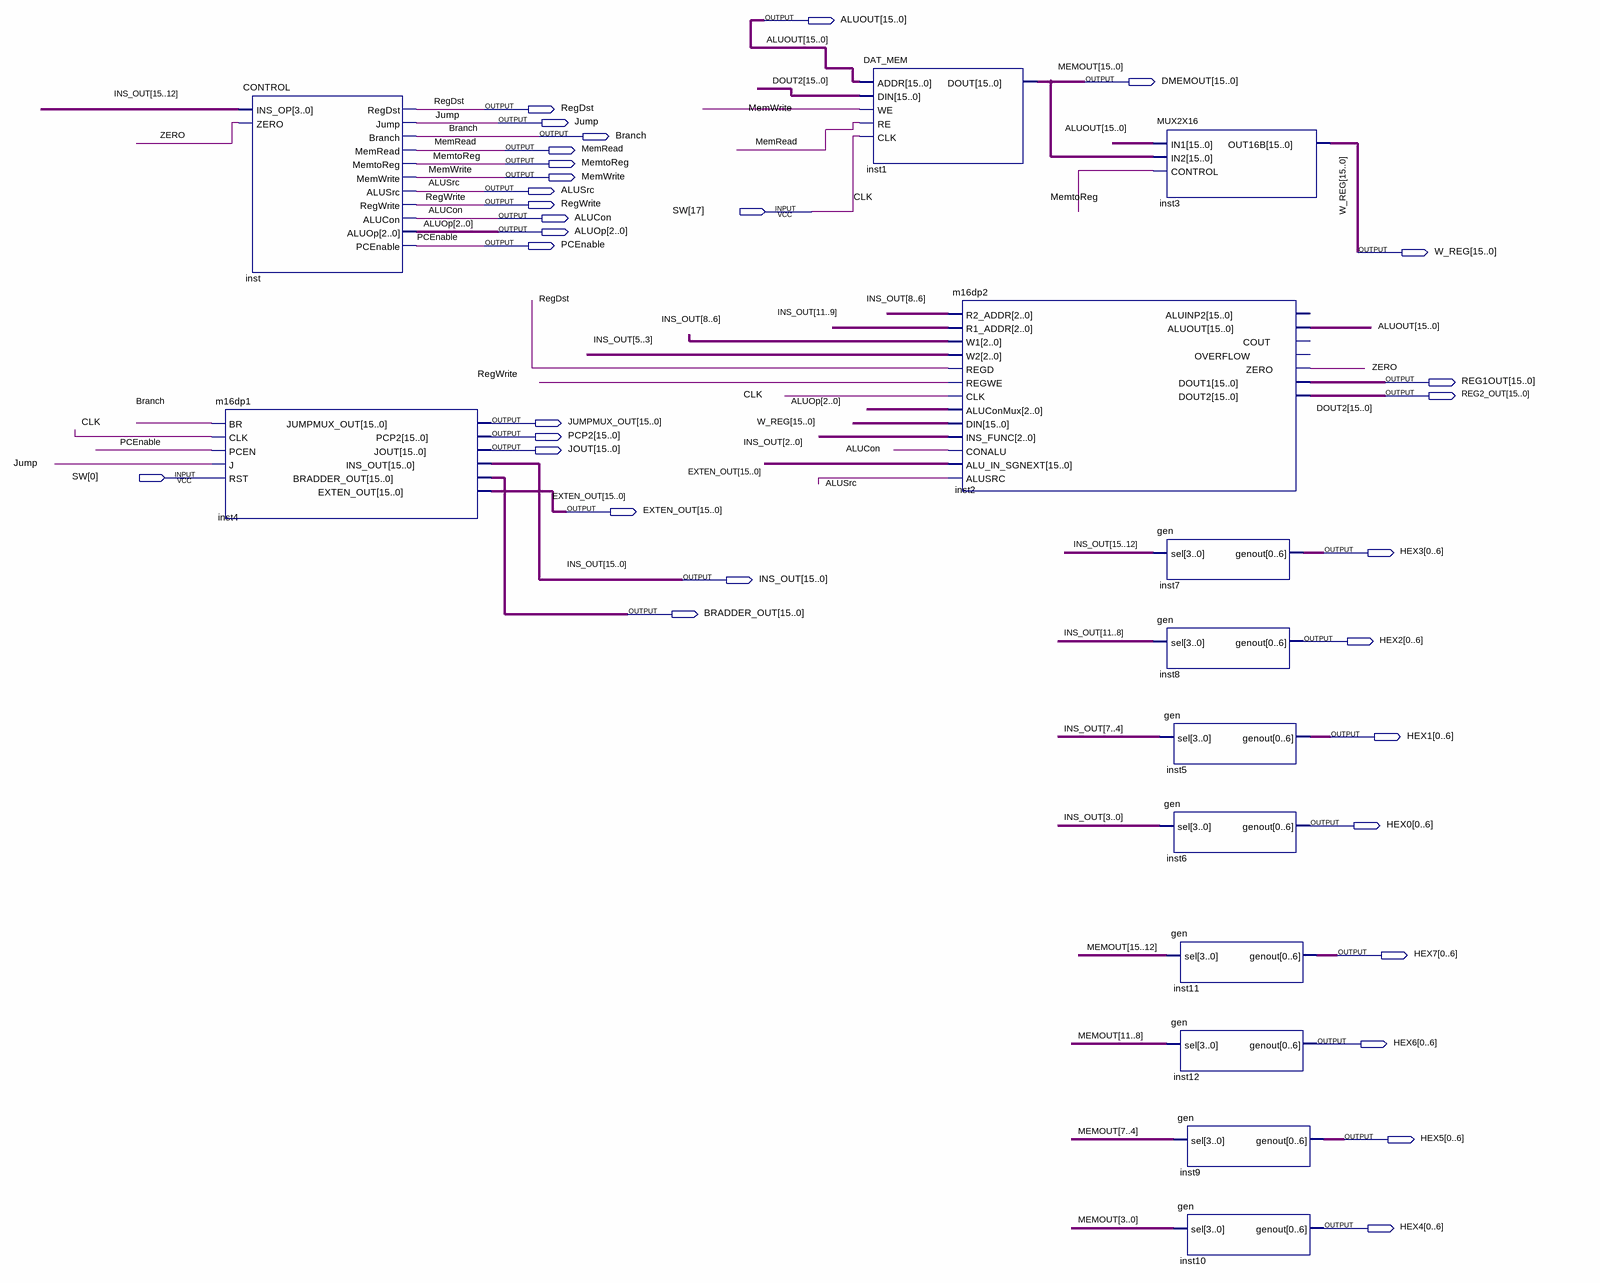
[diagram p0: schematic sheet]
// Quartus schematic m16dp.bdf as structural Verilog: 13 symbols, 32 pins
module m16dp (
  input  [17:0] SW,
  output [15:0] ALUOUT,
  output [15:0] DMEMOUT,
  output RegDst,
  output Jump,
  output Branch,
  output MemRead,
  output MemtoReg,
  output MemWrite,
  output ALUSrc,
  output RegWrite,
  output ALUCon,
  output [2:0] ALUOp,
  output PCEnable,
  output [15:0] W_REG,
  output [15:0] REG1OUT,
  output [15:0] REG2_OUT,
  output [15:0] JUMPMUX_OUT,
  output [15:0] PCP2,
  output [15:0] JOUT,
  output [15:0] EXTEN_OUT,
  output [0:6] HEX3,
  output [15:0] INS_OUT,
  output [15:0] BRADDER_OUT,
  output [0:6] HEX2,
  output [0:6] HEX1,
  output [0:6] HEX0,
  output [0:6] HEX7,
  output [0:6] HEX6,
  output [0:6] HEX5,
  output [0:6] HEX4
);

  wire ZERO;

  m16dp1 inst4 (
    .BR(Branch), .CLK(SW[17]), .PCEN(PCEnable), .J(Jump), .RST(SW[0]), .JUMPMUX_OUT(JUMPMUX_OUT),
    .PCP2(PCP2), .JOUT(JOUT), .INS_OUT(INS_OUT), .BRADDER_OUT(BRADDER_OUT), .EXTEN_OUT(EXTEN_OUT));
  CONTROL inst (
    .INS_OP(INS_OUT[15:12]), .ZERO(ZERO), .RegDst(RegDst), .Jump(Jump), .Branch(Branch), .MemRead(MemRead),
    .MemtoReg(MemtoReg), .MemWrite(MemWrite), .ALUSrc(ALUSrc), .RegWrite(RegWrite), .ALUCon(ALUCon),
    .ALUOp(ALUOp), .PCEnable(PCEnable));
  DAT_MEM inst1 (.ADDR(ALUOUT), .DIN(REG2_OUT), .WE(MemWrite), .RE(MemRead), .CLK(SW[17]), .DOUT(DMEMOUT));
  m16dp2 inst2 (
    .R2_ADDR(INS_OUT[8:6]), .R1_ADDR(INS_OUT[11:9]), .W1(INS_OUT[8:6]), .W2(INS_OUT[5:3]), .REGD(RegDst),
    .REGWE(RegWrite), .CLK(SW[17]), .ALUConMux(ALUOp), .DIN(W_REG), .INS_FUNC(INS_OUT[2:0]), .CONALU(ALUCon),
    .ALU_IN_SGNEXT(EXTEN_OUT), .ALUSRC(ALUSrc), .ALUOUT(ALUOUT), .ZERO(ZERO), .DOUT1(REG1OUT),
    .DOUT2(REG2_OUT));  // open: ALUINP2, COUT, OVERFLOW
  MUX2X16 inst3 (.IN1(ALUOUT), .IN2(DMEMOUT), .CONTROL(MemtoReg), .OUT16B(W_REG));
  gen inst7 (.sel(INS_OUT[15:12]), .genout(HEX3));
  gen inst8 (.sel(INS_OUT[11:8]), .genout(HEX2));
  gen inst5 (.sel(INS_OUT[7:4]), .genout(HEX1));
  gen inst6 (.sel(INS_OUT[3:0]), .genout(HEX0));
  gen inst11 (.sel(DMEMOUT[15:12]), .genout(HEX7));
  gen inst12 (.sel(DMEMOUT[11:8]), .genout(HEX6));
  gen inst9 (.sel(DMEMOUT[7:4]), .genout(HEX5));
  gen inst10 (.sel(DMEMOUT[3:0]), .genout(HEX4));

  // Other names for the same wires on the sheet: CLK = SW[17]; DOUT2[15:0] = REG2_OUT; MEMOUT[15:0] = DMEMOUT
endmodule
